# EAGLE design test2 (EAGLE 6.5.0)
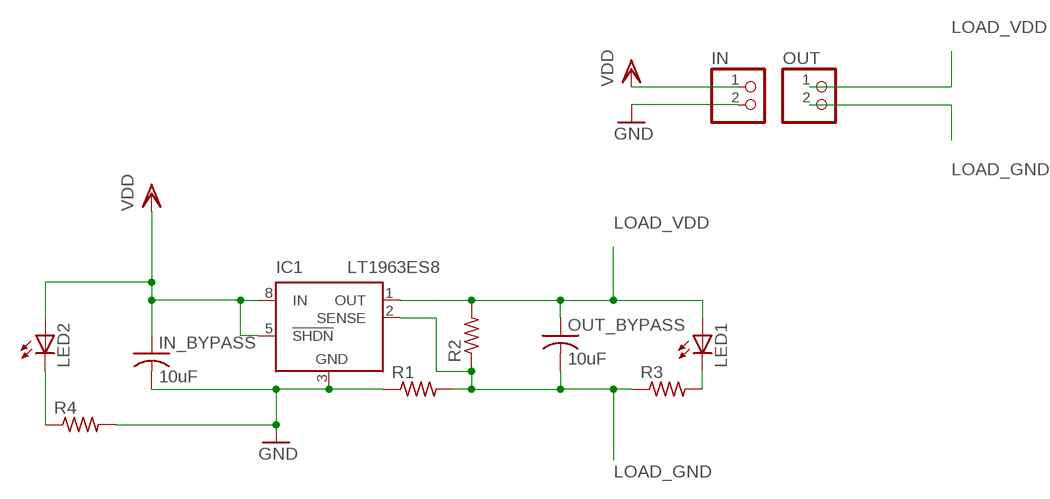
[diagram p0: schematic, sheet 1]

## Parts
IC1  LT1963ES8  [SOIC8]
IN  PINHD-1X2  [1X02]
IN_BYPASS  10uF  C-USC1206  [C1206]
LED1  LEDCHIPLED_1206  [CHIPLED_1206]
LED2  LEDCHIPLED_1206  [CHIPLED_1206]
OUT  PINHD-1X2  [1X02]
OUT_BYPASS  10uF  C-USC1206  [C1206]
R1  R-US_R1206  [R1206]
R2  R-US_R1206  [R1206]
R3  R-US_R1206  [R1206]
R4  R-US_R1206  [R1206]

## Nets
GND [gnd]: IC1.3(GND) IN.2 IN_BYPASS.2 R1.1 R4.2
LOAD_GND: IC1.2(SENSE) OUT.2 OUT_BYPASS.2 R1.2 R2.1 R3.1
LOAD_VDD: IC1.1(OUT) LED1.A OUT.1 OUT_BYPASS.1 R2.2
N$2: LED2.C R4.1
N$3: LED1.C R3.2
VDD: IC1.5(!SHDN) IC1.8(IN) IN.1 IN_BYPASS.1 LED2.A
Unconnected: IC1.4(NC)

## Power pins joined to a net without a drawn wire
GND: IC1.6(GND) IC1.7(GND)

## Library data of the parts
IC1 = linear-technology:LT1963ES8: 1.5A, Low Noise, Fast Transient Response LDO Regulator Source: http://www.linear.com/pc/downloadDocument.do?navId=H0,C3,P2222,D3148; MPN: LT1963ES8; OC_FARNELL: unknown; OC_NEWARK: 57M7550
IN OUT = pinhead:PINHD-1X2: PIN HEADER
IN_BYPASS OUT_BYPASS = adafruit:C-US: CAPACITOR, American symbol
LED1 LED2 = adafruit:LED: LED OSRAM: - CHIPLED LG R971, LG N971, LY N971, LG Q971, LY Q971, LO R971, LY R971 LH N974, LH R974 LS Q976, LO Q976, LY Q976 LO Q996 - Hyper CHIPLED LW Q18S LB Q993, LB Q99A, LB R99A - SideLED LS A670, LO A670, LY A670, LG A670, LP A670 LB A673, LV A673, LT A673, LW A673 LH A674 LY A675 LS A676, LA A676, LO A676, LY A676, LW A676 LS A679, LY A679, LG A679 - Hyper Micro SIDELED® LS Y876, LA Y876, LO Y876, LY Y876 LT Y87S - SmartLED LW L88C, LW L88S LB L89C, LB L89S, LG L890 LS L89K, LO L89K, LY L89K LS L896, LA L896, LO L896, LY L896 - TOPLED LS T670, LO T670, LY T670, LG T670, LP T670 LSG T670, LSP T670, LSY T670, LOP T670, LYG T670 LG T671, LOG T671, LSG T671 LB T673, LV T673, LT T673, LW T673 LH T674 LS T676, LA T676, LO T676, LY T676, LB T676, LH T676, LSB T676, LW T676 LB T67C, LV T67C, LT T67C, LS T67K, LO T67K, LY T67K, LW E67C LS E67B, LA E67B, LO E67B, LY E67B, LB E67C, LV E67C, LT E67C LW T67C LS T679, LY T679, LG T679 LS T770, LO T770, LY T770, LG T770, LP T770 LB T773, LV T773, LT T773, LW T773 LH T774 LS E675, LA E675, LY E675, LS T675 LS T776, LA T776, LO T776, LY T776, LB T776 LHGB T686 LT T68C, LB T68C - Hyper Mini TOPLED® LB M676 - Mini TOPLED Santana® LG M470 LS M47K, LO M47K, LY M47K Source: http://www.osram.convergy.de/
R1-R4 = adafruit:R-US_: RESISTOR, American symbol

## Net classes
0 default: width 0.508 mm
1 gnd: width 0.508 mm

## Board
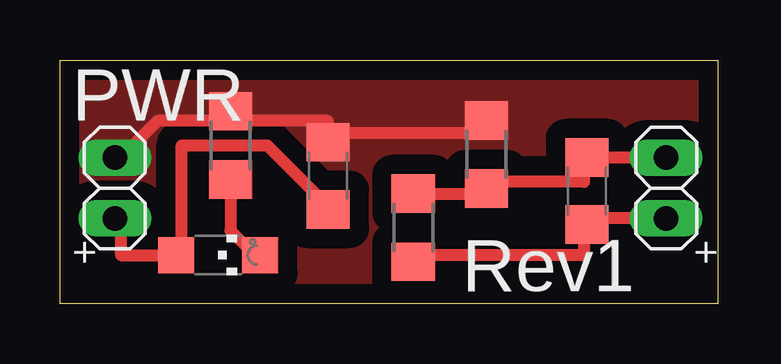
[diagram p1: board, top side]
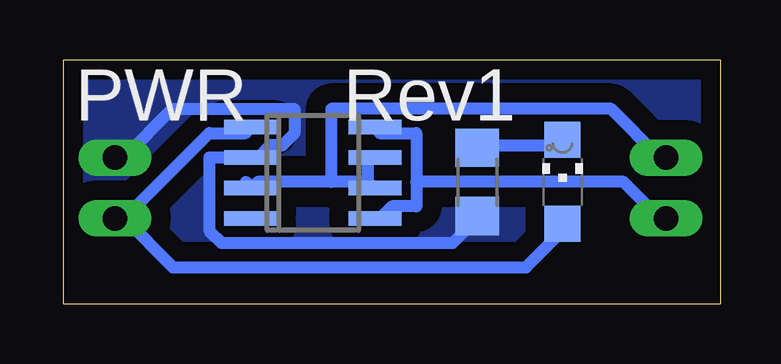
[diagram p2: board, bottom side, seen from below]

Size 27.43 x 10.16 mm. Coordinates in mm from the lower left corner, seen from the top.
Outline: 27.43,10.16 27.43,0 0,0 0,10.16 27.43,10.16
Copper layers (1*16): Top 0.0356mm / dielectric 1.5011mm / Bottom 0.0356mm
Design rules "LaenPCBOrder": minimum track width 6mil, minimum drill 13mil, track to track 6mil, track to pad 6mil, pad to pad 6mil, via to via 6mil, smd to smd 6mil, copper to edge 15mil, drill to drill 6mil, minimum pad ring 7mil, minimum via ring 7mil, stop-mask expansion 3mil, vias tented up to drill 0mil, thermal gap 10mil

### Footprints (pad centres in the part's own frame; a part is rotated, then mirrored left to right if it is on the bottom)
SOIC8 = smd 0.6 x 2.2: 1 -1.905,-2.6; 2 -0.635,-2.6; 3 0.635,-2.6; 4 1.905,-2.6; 5 1.905,2.6; 6 0.635,2.6; 7 -0.635,2.6; 8 -1.905,2.6
1X02 = drill 1.016 long: 1 -1.27,0; 2 1.27,0
C1206 = smd 1.6 x 1.8: 1 -1.4,0; 2 1.4,0
CHIPLED_1206 = smd 1.5 x 1.5: A 0,-1.75; C 0,1.75
R1206 = smd 1.6 x 1.803: 1 -1.422,0; 2 1.422,0

### Placement (x,y rotation side)
IC1  17.02,5.46 270 bottom
IN  2.29,4.83 90 top
IN_BYPASS  11.18,5.33 90 top
LED1  6.6,5.08 0 bottom
LED2  6.6,2.03 270 top
OUT  25.27,4.83 90 top
OUT_BYPASS  21.97,4.7 90 top
R1  17.78,6.22 270 top
R2  14.73,3.18 270 top
R3  10.16,5.08 90 bottom
R4  7.11,6.6 90 top

### Tracks (layer width: path | path; a pad name or v marks a point on that pad's centre or on a via)
GND
  Top 0.508: 11.18,7.11 17.78,7.11 17.78,7.62 R1.1 | 11.18,7.11 IN_BYPASS.2 11.18,7.11 | 7.11,7.62 11.18,7.62 11.18,7.11 | 7.11,7.62 R4.2 7.11,7.62 | 7.11,7.62 4.06,7.62 2.54,6.1 IN.2
  Bottom 0.508: IC1.3 19.81,5.08 IC1.3 | 14.73,5.08 14.73,6.1 IC1.7 | 14.73,5.08 IC1.6 14.73,5.08 | 14.73,5.08 16.26,5.08 | 16.26,5.08 19.3,5.08 IC1.3 | 16.26,5.08 16.26,8.13 4.57,8.13 2.54,6.1 IN.2
  pour Top (isolate 0.813, no thermals): 0,10.16 27.43,10.16 27.43,0 0,0
LOAD_GND
  Top 0.508: R2.1 14.73,4.57 17.78,4.57 R1.2 17.78,5.08 21.84,5.08 21.84,6.1 OUT_BYPASS.2 22.35,6.1 24.89,6.1 OUT.2
  Bottom 0.508: R3.1 10.16,3.56 11.18,2.54 20.83,2.54 21.34,3.05 21.34,6.1 19.81,6.1 IC1.2 19.3,6.1 18.8,6.6 18.29,6.6 17.78,7.11 17.78,8.13 22.86,8.13 24.89,6.1 OUT.2
  pour Bottom (isolate 0.813, no thermals): 0,10.16 27.43,10.16 27.43,0 0,0
LOAD_VDD
  Top 0.508: OUT.1 24.89,3.56 22.35,3.56 OUT_BYPASS.1 21.84,3.05 21.84,2.03 14.73,2.03 R2.2
  Bottom 0.508: 24.89,3.56 22.86,1.52 8.13,1.52 6.6,3.05 LED1.A | 24.89,3.56 OUT.1 24.89,3.56 | 24.89,3.56 21.34,7.11 19.81,7.11 IC1.1
N$2
  Top 0.508: LED2.C 8.13,2.03 7.11,3.05 7.11,5.08 R4.1
N$3
  Bottom 0.508: LED1.C 6.6,6.6 10.16,6.6 R3.2
VDD
  Top 0.508: IN.1 2.54,3.56 2.54,2.03 4.57,2.03 LED2.A 5.08,2.03 5.08,6.6 8.64,6.6 11.18,4.06 IN_BYPASS.1
  Bottom 0.508: 12.7,5.08 12.7,7.11 14.22,7.11 IC1.8 | 12.7,5.08 12.7,4.06 13.72,4.06 14.22,3.56 IC1.5 | 12.7,5.08 4.06,5.08 2.54,3.56 IN.1

### Text on the board
tPlace: PWR | Rev1
bPlace: Rev1 | PWR
tNames: + | +